# EAGLE design BergProbe-Adapter (EAGLE 8.2.2)
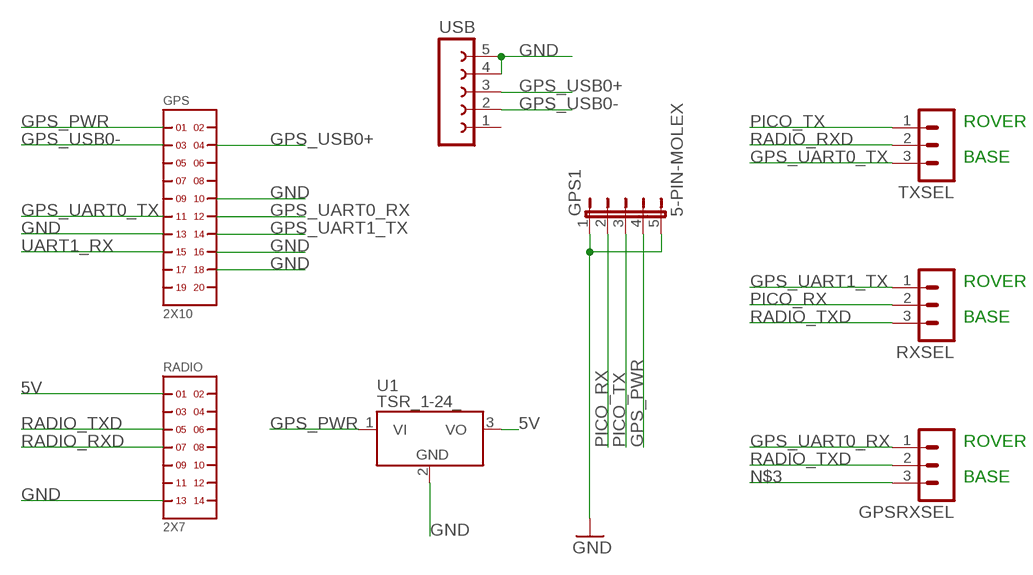
[diagram p0: schematic, sheet 1]

## Parts
GPS  2X10  [2X10]
GPS1  5-PIN-MOLEX  [5-MOLEX]
GPSRXSEL  MA03-1  [MA03-1]
RADIO  2X7  [2X7]
RXSEL  MA03-1  [MA03-1]
TXSEL  MA03-1  [MA03-1]
U1  TSR_1-24_  [TSR-1]
USB  FE05-1  [FE05-1]

## Nets
5V: RADIO.1 U1.3(VO)
GND: GPS1.1 GPS1.5 GPS.10 GPS.13 GPS.16 GPS.18 RADIO.13 U1.2(GND) USB.4 USB.5
GPS_PWR: GPS1.4 GPS.1 U1.1(VI)
GPS_UART0_RX: GPS.12 GPSRXSEL.1
GPS_UART0_TX: GPS.11 TXSEL.3
GPS_UART1_TX: GPS.14 RXSEL.1
GPS_USB0+: GPS.4 USB.3
GPS_USB0-: GPS.3 USB.2
N$3: GPSRXSEL.3
PICO_RX: GPS1.2 RXSEL.2
PICO_TX: GPS1.3 TXSEL.1
RADIO_RXD: RADIO.7 TXSEL.2
RADIO_TXD: GPSRXSEL.2 RADIO.5 RXSEL.3
UART1_RX: GPS.15
Unconnected: GPS.2 GPS.5 GPS.6 GPS.7 GPS.8 GPS.9 GPS.17 GPS.19 GPS.20 RADIO.2 RADIO.3 RADIO.4 RADIO.6 RADIO.8 RADIO.9 RADIO.10 RADIO.11 RADIO.12 RADIO.14 USB.1

## Notes on the sheet
- ROVER
- BASE
- ROVER
- BASE
- ROVER
- BASE

## Library data of the parts
GPS = headers(2mm)(samtec):2X10
GPS1 = farnell-parts:5-PIN-MOLEX
GPSRXSEL RXSEL TXSEL = con-lstb:MA03-1: PIN HEADER; OC_FARNELL: unknown; OC_NEWARK: unknown
RADIO = headers(2mm)(samtec):2X7
U1 = _traco_tsr-1:TSR_1-*: TRACO TSR-1 Series Point-of-Load DC/DC-Converters Vi max. 36 V; Vo = (1.2 .. 15)V ±2%; Io = 0 .. 1 A SIP-Package (drop-in replacement for 78xx linear voltage regulators in TO220-package, vertically assembled) Source: www.tracopower.com Technologies: TSR 1- Vi (V) Vo (V) ±2% Io = 0 .. 1 A 24_ ( generic ) 2412 4.6 .. 36 1.2 2415 4.6 .. 36 1.5 2418 4.6 .. 36 1.8 2425 4.6 .. 36 2.5 2433 4.75.. 36 3.3 2450 6.5 .. 36 5.0 2465 9.0 .. 36 6.5 2490 12 .. 36 9.0 24120 15 .. 36 12 24150 18 .. 36 15 Author: Dipl.-Ing. FH Rainer Bayer HHN Hochschule Heilbronn, rainer.bayer@hs-heilbronn.de Ingenieurbüro ing-rb, mail@ing-rb.de
USB = con-lsta:FE05-1: FEMALE HEADER; OC_FARNELL: unknown; OC_NEWARK: unknown

## Net classes
0 default: width 0.33 mm, drill 0.254 mm, clearance 0.33 mm

## Board
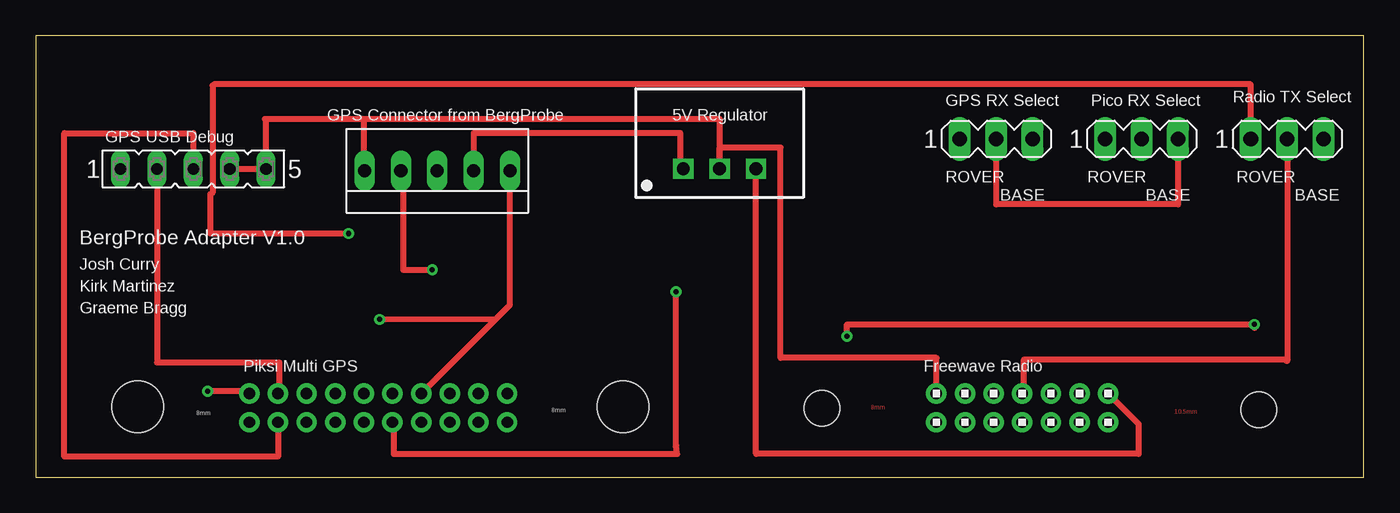
[diagram p1: board, top side]
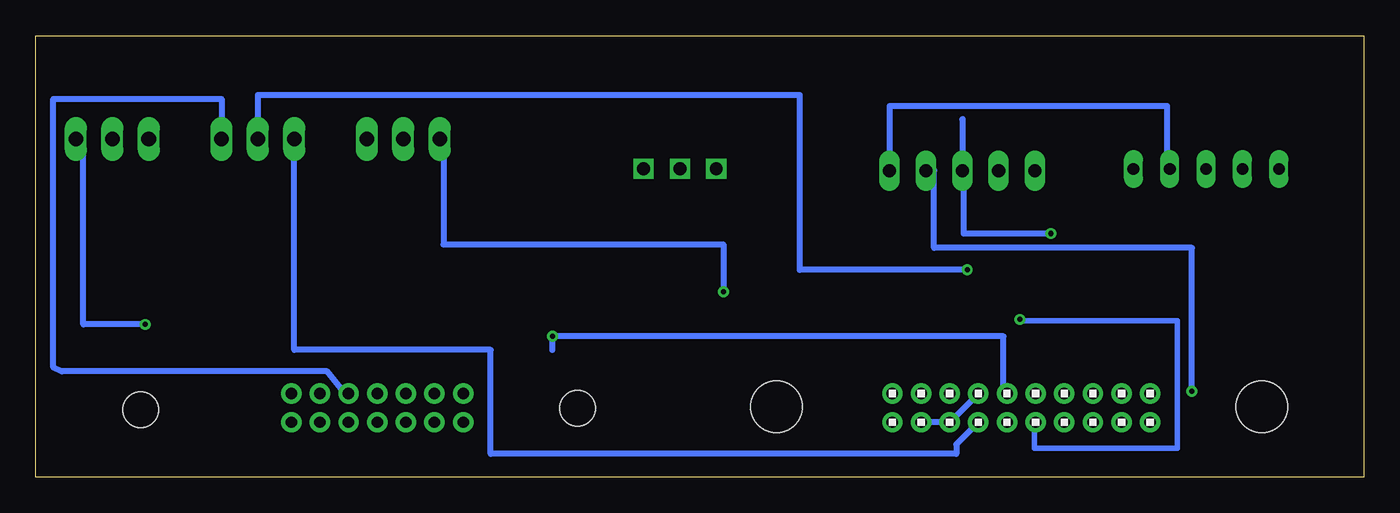
[diagram p2: board, bottom side, seen from below]

Size 92.72 x 30.8 mm. Coordinates in mm from the lower left corner, seen from the top.
Outline: 0,0 92.72,0 92.72,30.8 0,30.8 0,0
Copper layers (1*16): Top 0.035mm / dielectric 1.5mm / Bottom 0.035mm
Design rules "default": minimum track width 6mil, minimum drill 0.35mm, track to track 6mil, track to pad 6mil, pad to pad 6mil, via to via 6mil, smd to smd 6mil, copper to edge 40mil, drill to drill 6mil, minimum pad ring 10mil, minimum via ring 8mil, stop-mask expansion 4mil, vias tented up to drill 0mil, thermal gap 10mil
Holes 3.6 mm at 41,4.9 7.1,4.9
Holes 2.5 mm at 54.9,4.8 85.4,4.7

### Footprints (pad centres in the part's own frame; a part is rotated, then mirrored left to right if it is on the bottom)
2X10 = drill 0.8 pad 1.422: 1 0,0; 2 0,2; 3 2,0; 4 2,2; 5 4,0; 6 4,2; 7 6,0; 8 6,2; 9 8,0; 10 8,2; 11 10,0; 12 10,2; 13 12,0; 14 12,2; 15 14,0; 16 14,2; 17 16,0; 18 16,2; 19 18,0; 20 18,2
5-MOLEX = drill 0.914 long: 1 -3.937,-0.127; 2 -1.397,-0.127; 3 1.143,-0.127; 4 3.683,-0.127; 5 6.223,-0.127
MA03-1 = drill 1.016 long: 1 -2.54,0; 2 0,0; 3 2.54,0
2X7 = drill 0.8 pad 1.422: 1 0,0; 2 0,2; 3 2,0; 4 2,2; 5 4,0; 6 4,2; 7 6,0; 8 6,2; 9 8,0; 10 8,2; 11 10,0; 12 10,2; 13 12,0; 14 12,2
TSR-1 = drill 0.9 square: 1 -2.54,0; 2 0,0; 3 2.54,0
FE05-1 = drill 0.813 long: 1 -5.08,0; 2 -2.54,0; 3 0,0; 4 2.54,0; 5 5.08,0

### Placement (x,y rotation side)
GPS  14.91,5.83 180 bottom
GPS1  26.89,21.51 0 top
GPSRXSEL  67.06,23.61 0 top
RADIO  74.88,5.83 180 top
RXSEL  77.22,23.61 0 top
TXSEL  87.38,23.61 0 top
U1  47.75,21.51 0 top
USB  11,21.51 0 top

### Tracks (layer width: path | path; a pad name or v marks a point on that pad's centre or on a via)
5V
  Top 0.406: RADIO.1 77,3.71 77,1.62 50.29,1.62 U1.3
GND  (via drill 0.35)
  Top 0.4: v24,11 32.1,11 32.1,11.02
  Top 0.406: USB.4 USB.5 16.08,24.92 16,25 22.91,25 | RADIO.13 62.9,8.33 52,8.33 52,23 47.75,23 U1.2 47.75,25 22.91,25 | GPS1.1 22.91,21.38 22.91,25 | GPS.13 32.1,11.02 33.11,12.03 GPS1.5
  Bottom 0.4: GPS.10 23,3.83 23,2 13,2 13,10.9 24,10.9 v24,11
  Bottom 0.406: 22.83,3.83 GPS.10 | GPS.18 GPS.16 GPS.13 | USB.4 13.72,21 13.72,25.89 33.11,25.89 GPS1.5
GPS_PWR  (via drill 0.35)
  Top 0.406: GPS.1 14.91,6 v12,6 | U1.1 45,21.51 45,24 30.57,24 GPS1.4
  Bottom 0.406: v12,6 12,16 30,16 30,21.38 GPS1.4
GPS_UART0_RX  (via drill 0.35)
  Top 0.406: GPS.12 25,3.73 25,1.62 44.78,1.62 44.7,2.22 v44.7,12.94
  Bottom 0.406: GPSRXSEL.1 64.26,23.61 64.26,16.24 44.7,16.24 v44.7,12.94
GPS_UART0_TX  (via drill 0.35)
  Top 0.406: v56.64,9.82 56.64,10.65 v85.09,10.65 85.09,10.4
  Bottom 0.406: TXSEL.3 89.41,23.61 89.41,10.65 v85.09,10.65 | GPS.11 25.15,5.83 25.15,9.82 v56.64,9.82 56.64,8.87
GPS_UART1_TX
  Bottom 0.406: GPS.14 28.45,2.29 28.45,1.62 60.96,1.62 60.96,8.87 74.68,8.87 RXSEL.1
GPS_USB0+
  Top 0.406: GPS.4 16.91,1.42 2,1.42 2,24 11,24 USB.3
GPS_USB0-
  Top 0.406: USB.2 8.46,8 17,8 17,5.83 GPS.3
PICO_RX  (via drill 0.35)
  Top 0.406: GPS1.2 25.65,21.38 25.65,14.46 v27.69,14.46
  Bottom 0.406: v27.69,14.46 39.37,14.46 39.37,26.65 77.22,26.65 RXSEL.2
PICO_TX  (via drill 0.35)
  Top 0.406: TXSEL.1 84.84,27.42 12.45,27.42 12.35,27.32 12.35,19.84 12.19,19.75 12.19,17 v21.84,17
  Bottom 0.406: 28,25 28.03,24.97 GPS1.3 27.94,21.38 27.94,17 v21.84,17
RADIO_RXD
  Top 0.406: RADIO.7 69,5.83 69,8.2 87.34,8.2 87.34,8.11 87.38,8.11 TXSEL.2
RADIO_TXD
  Top 0.406: RXSEL.3 79.76,19.03 67.06,19.03 GPSRXSEL.2
  Bottom 0.406: RADIO.5 71.12,5.83 72.36,7.37 90.91,7.37 91.5,7.67 91.5,26.4 79.76,26.4 RXSEL.3

### Text on the board
Top: 8mm | 10.5mm
tNames: GPS RX Select | Pico RX Select | Radio TX Select | GPS Connector from BergProbe | 5V Regulator | GPS USB Debug | ROVER | ROVER | ROVER | BASE | BASE | BASE | BergProbe Adapter V1.0 | Josh Curry | Kirk Martinez | Graeme Bragg | Piksi Multi GPS | Freewave Radio | 8mm | 8mm